# Altium schematic sheet PCB_Board2.SchDoc
size A; SheetNumber: 1; SheetTotal: 1
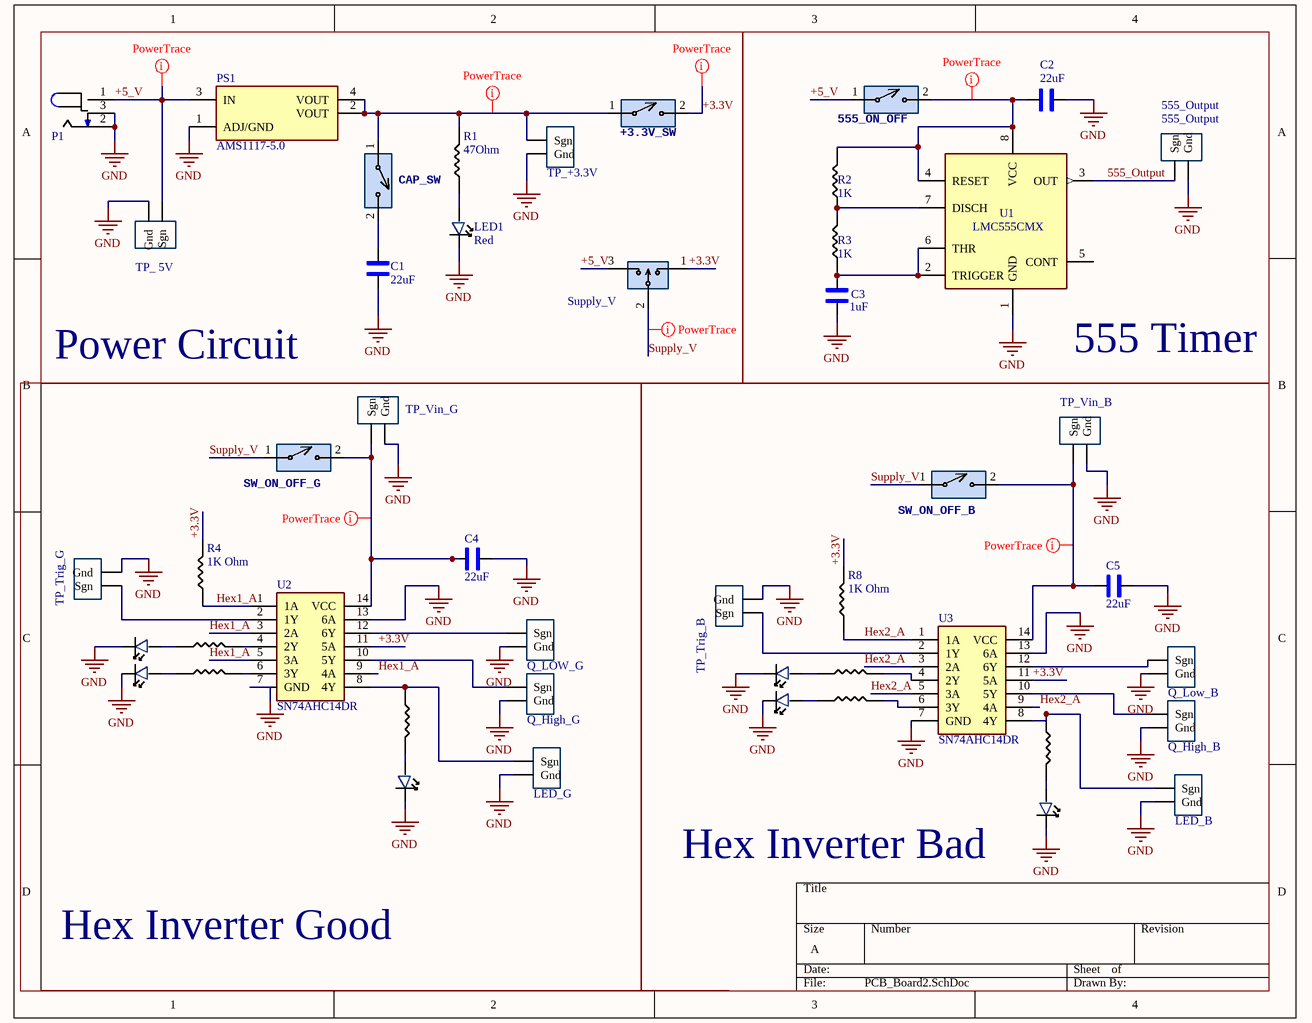
[diagram p0: PCB_Board2.SchDoc]

## Parts
555_ON_OFF  SW_2Pin_100mil_Switch  [2Pin-Header-Conn]  (value not drawn)
555_Output  555_Output  [TP10x_Probe]
+3.3V_SW  SW_2Pin_100mil_Switch  [2Pin-Header-Conn]  (value not drawn)
C1  22uF  [1206_Passive_Capacitor]
C2  22uF  [1206_Passive_Capacitor]
C3  1uF  [1206_Passive_Capacitor]
C4  22uF  [1206_Passive_Capacitor]
C5  22uF  [1206_Passive_Capacitor]
CAP_SW  SW_2Pin_100mil_Switch  [2Pin-Header-Conn]  (value not drawn)
LED1  Red  [LED_1206]
LED2  Red  [LED_1206]  (value not drawn)
LED3  Red  [LED_1206]  (value not drawn)
LED4  Red  [LED_1206]  (value not drawn)
LED5  Red  [LED_1206]  (value not drawn)
LED6  Red  [LED_1206]  (value not drawn)
LED7  Red  [LED_1206]  (value not drawn)
LED_B  10x Probe TP  [TP10x_Probe]  (value not drawn)
LED_G  10x Probe TP  [TP10x_Probe]  (value not drawn)
P1  Power Jack  [Power_Jack]  (value not drawn)
PS1  AMS1117-5.0  [LDO]
Q_High_B  10x Probe TP  [TP10x_Probe]  (value not drawn)
Q_High_G  10x Probe TP  [TP10x_Probe]  (value not drawn)
Q_Low_B  10x Probe TP  [TP10x_Probe]  (value not drawn)
Q_LOW_G  10x Probe TP  [TP10x_Probe]  (value not drawn)
R1  value 47Ohm  [1206_Passive_Resitor]  (hidden comment: 47 Ohms)
R2  1k  [1206_Passive_Resitor]
R3  1k  [1206_Passive_Resitor]
R4  value 1K Ohm  [1206_Passive_Resitor]  (hidden comment: 1k)
R5  2Ohm  [1206_Passive_Resitor]  (value not drawn)
R6  2Ohm  [1206_Passive_Resitor]  (value not drawn)
R7  2Ohm  [1206_Passive_Resitor]  (value not drawn)
R8  value 1K Ohm  [1206_Passive_Resitor]  (hidden comment: 1k)
R9  2Ohm  [1206_Passive_Resitor]  (value not drawn)
R10  2Ohm  [1206_Passive_Resitor]  (value not drawn)
R11  2Ohm  [1206_Passive_Resitor]  (value not drawn)
Supply_V  PREC003SAAN-RC  [3_PIN_100mil]  (value not drawn)
SW_ON_OFF_B  SW_2Pin_100mil_Switch  [2Pin-Header-Conn]  (value not drawn)
SW_ON_OFF_G  SW_2Pin_100mil_Switch  [2Pin-Header-Conn]  (value not drawn)
TP_+3.3V  10x Probe TP  [TP10x_Probe]  (value not drawn)
TP__5V  10x Probe TP  [TP10x_Probe]  (value not drawn)
TP_Trig_B  10x Probe TP  [TP10x_Probe]  (value not drawn)
TP_Trig_G  10x Probe TP  [TP10x_Probe]  (value not drawn)
TP_Vin_B  10x Probe TP  [TP10x_Probe]  (value not drawn)
TP_Vin_G  10x Probe TP  [TP10x_Probe]  (value not drawn)
U1  LMC555CMX  [TS555IDTTR]
U2  SN74AHC14DR  [HEX_74AC14]
U3  SN74AHC14DR  [HEX_74AC14]

## Blocks framed on the sheet
Power Circuit: +3.3V_SW C1 CAP_SW LED1 P1 PS1 R1 Supply_V TP_+3.3V TP__5V
555 Timer: 555_ON_OFF 555_Output C2 C3 R2 R3 U1
Hex Inverter Good: C4 LED2-LED4 LED_G Q_High_G Q_LOW_G R4-R7 SW_ON_OFF_G TP_Trig_G TP_Vin_G U2
Hex Inverter Bad: C5 LED5-LED7 LED_B Q_High_B Q_Low_B R8-R11 SW_ON_OFF_B TP_Trig_B TP_Vin_B U3

## Nets
GND: 555_Output.2(Gnd) C1.1 C2.2 C3.2 C4.1 C5.1 LED1.2 LED2.2 LED3.2 LED4.2 LED5.2 LED6.2 LED7.2 LED_B.2(Gnd) LED_G.2(Gnd) P1.2 P1.3 PS1.1(ADJ/GND) Q_High_B.2(Gnd) Q_High_G.2(Gnd) Q_Low_B.2(Gnd) Q_LOW_G.2(Gnd) TP_+3.3V.2(Gnd) TP__5V.2(Gnd) TP_Trig_B.2(Gnd) TP_Trig_G.2(Gnd) TP_Vin_B.2(Gnd) TP_Vin_G.2(Gnd) U1.1(GND) U2.7(GND) U2.13(6A) U3.7(GND) U3.13(6A)
555_Output: 555_Output.1(Sgn) U1.3(OUT)
+3.3V: +3.3V_SW.2 R4.2 R8.2 Supply_V.1 U2.11(5A) U3.11(5A)
+5_V: 555_ON_OFF.1 P1.1 PS1.3(IN) Supply_V.3 TP__5V.1(Sgn)
Hex1_A: R4.1 U2.1(1A) U2.3(2A) U2.5(3A) U2.9(4A)
Hex2_A: R8.1 U3.1(1A) U3.3(2A) U3.5(3A) U3.9(4A)
Supply_V: Supply_V.2 SW_ON_OFF_B.1 SW_ON_OFF_G.1
Net555_ON_OFF_2: 555_ON_OFF.2 C2.1 R2.2 U1.4(RESET) U1.8(VCC)
Net+3.3V_SW_1: +3.3V_SW.1 CAP_SW.1 PS1.2(VOUT) PS1.4(VOUT) R1.2 TP_+3.3V.1(Sgn)
NetC1_2: C1.2 CAP_SW.2
NetC3_1: C3.1 R3.1 U1.2(TRIGGER) U1.6(THR)
NetC4_2: C4.2 SW_ON_OFF_G.2 TP_Vin_G.1(Sgn) U2.14(VCC)
NetC5_2: C5.2 SW_ON_OFF_B.2 TP_Vin_B.1(Sgn) U3.14(VCC)
NetLED1_1: LED1.1 R1.1
NetLED2_1: LED2.1 R5.1
NetLED3_1: LED3.1 R6.1
NetLED4_1: LED4.1 R7.2
NetLED5_1: LED5.1 R9.1
NetLED6_1: LED6.1 R10.1
NetLED7_1: LED7.1 R11.2
NetLED_B_1: LED_B.1(Sgn) R11.1 U3.8(4Y)
NetLED_G_1: LED_G.1(Sgn) R7.1 U2.8(4Y)
NetQ_High_B_1: Q_High_B.1(Sgn) U3.10(5Y)
NetQ_High_G_1: Q_High_G.1(Sgn) U2.10(5Y)
NetQ_Low_B_1: Q_Low_B.1(Sgn) U3.12(6Y)
NetQ_LOW_G_1: Q_LOW_G.1(Sgn) U2.12(6Y)
NetR2_1: R2.1 R3.2 U1.7(DISCH)
NetR5_2: R5.2 U2.4(2Y)
NetR6_2: R6.2 U2.6(3Y)
NetR9_2: R9.2 U3.4(2Y)
NetR10_2: R10.2 U3.6(3Y)
NetTP_Trig_B_1: TP_Trig_B.1(Sgn) U3.2(1Y)
NetTP_Trig_G_1: TP_Trig_G.1(Sgn) U2.2(1Y)

Not connected (* = marked no-connect by the designer): U1 5(CONT)

## Layout directives
rule Width Constraint [Pref Width = 20mil    Min Width = 10mil    Max Width = 100mil]: +3.3V, +5_V, Net555_ON_OFF_2, Net+3.3V_SW_1, NetC4_2, NetC5_2, Supply_V

## Library data of the parts
555_ON_OFF +3.3V_SW CAP_SW SW_ON_OFF_B SW_ON_OFF_G = SW_2Pin_100mil_Switch: 2Pin Header; LCSC Part#: C124375; Type: Extended
555_Output LED_B LED_G Q_High_B Q_High_G Q_Low_B Q_LOW_G TP_+3.3V TP__5V TP_Trig_B TP_Trig_G TP_Vin_B TP_Vin_G = TP_10x_Probe: Test Point 300 mil centers
C1 C2 C4 C5 = C_22uF_1206: 22uF ±10% 25V X5R 1206 Multilayer Ceramic Capacitors MLCC - SMD/SMT RoHS; MFR Part #: CL31A226KAHNNNE; Type: basic; LCSC Part#: C12891; Datasheet: https://datasheet.lcsc.com/lcsc/1811031514_Samsung-Electro-Mechanics-CL31A226KAHNNNE_C12891.pdf; Value: 22uF
C3 = C_1uF_1206: MULTILAYER CERAMIC CAPACITORS MLCC - SMD/SMT 1UF 50V 1206 ROHS; MFR Part #: CL31B105KBHNNNE; Type: Basic; LCSC Part#: C1848; Value: 1uF; Digikey Link: https://www.digikey.com/product-detail/en/C1206C105M4RACTU/399-8150-1-ND/3471873/?itemSeq=304982366
LED1-LED7 = LED_RED_1206: Red 621~631nm 1206 Light Emitting Diodes (LED) RoHS; MFR Part #: 15-21/R6C-FQ1R1B/2T; Type: Extended; LCSC Part#: C93133; Datasheet: https://datasheet.lcsc.com/szlcsc/1811151241_Everlight-Elec-15-21-R6C-FQ1R1B-2T_C93133.pdf; Value: Red
P1 = P_Power Jack: Power Barrel Connector Jack 2.10mm ID (0.083"), 5.50mm OD (0.217") Through Hole, Right Angle; MFR Part #: PJ-102A; Value: CONN PWR JACK 2X5.5MM SOLDER; Digikey Link: https://www.digikey.com/product-detail/en/PJ-102A/CP-102A-ND/275425/?itemSeq=304982367; LCSC Part#: C136744; Type: Extended
PS1 = PS_AMS_LDO_5V: LOW DROPOUT REGULATORS(LDO) POSITIVE FIXED 1.3V @ 1A 15V 5V 1A SOT-223 ROHS; Value: IC REG LINEAR 5V 1A SOT223; MFR Part #: AMS1117-5.0; LCSC Part#: C6187; Type: Basic
R1 = R_47Ohm_1206: 47Ω ±5% 0.25W ±200ppm/℃ 1206 Chip Resistor - Surface Mount RoHS; MFR Part #: 1206W4J0470T5E; LCSC Part#: C25384; Type: Extended; Datasheet: https://datasheet.lcsc.com/lcsc/1811101020_UNI-ROYAL-Uniroyal-Elec-1206W4J0470T5E_C25384.pdf
R2-R4 R8 = R_1K_1206: CHIP RESISTOR - SURFACE MOUNT 1KOHMS ±1% 1/4W 1206 ROHS; MFR Part #: RNCP1206FTD1K00CT; Digikey Link: https://www.digikey.com/product-detail/en/RNCP1206FTD1K00/RNCP1206FTD1K00CT-ND/2240675/?itemSeq=304982373; LCSC Part#: C4410; Type: Basic
  R2 R3: Value: 1K
R5-R7 R9-R11 = R_2Ohm_1206: 2Ω ±1% 0.25W ±400ppm/℃ 1206 Chip Resistor - Surface Mount RoHS; MFR Part #: 1206W4F200KT5E; Value: 50 Ohm; LCSC Part#: C17942; Datasheet: https://datasheet.lcsc.com/lcsc/1809050635_UNI-ROYAL-Uniroyal-Elec-1206W4F200KT5E_C17942.pdf; Type: Extended
Supply_V = SW_3Pin_100mil_Switch: Connector Header Through Hole 3 position 0.100" (2.54mm); Value: CONN HEADER VERT 3POS 2.54MM; Digikey Link: https://www.digikey.com/product-detail/en/PREC003SAAN-RC/S1012EC-03-ND/2774851/?itemSeq=304982371; MFR Part #: PREC003SAAN-RC; Type: Extended; LCSC Part#: C49257
U1 = U_555_Fast: 555 Type, Timer/Oscillator _Single_ IC 3MHz 8-SO; MFR Part #: LMC555CMX/NOPB; Package: SOIC-8; DigiKey link: https://www.digikey.com/product-detail/en/texas-instruments/LMC555CMX-NOPB/LMC555CMX-NOPBCT-ND/1010550; LCSC Part#: C90760; Type: Extended
U2 U3 = U_74AHC14: Inverter IC 6 Channel Schmitt Trigger 14-SOIC; Datasheet: https://datasheet.lcsc.com/szlcsc/ON-Semicon-ON-74AC14SCX_C5482.pdf; MFR Part #: SN74AHC14DR; LCSC Part#: C6942; Type: Extended